# Altium schematic sheet AnalogValuePreparation.SchDoc
size A4; Address1: TH Nürnberg; Address2: Georg Simon Ohm; Address3: Kesslerplatz 10; Address4: 90489 Nürnberg; SheetNumber: 7; SheetTotal: 8
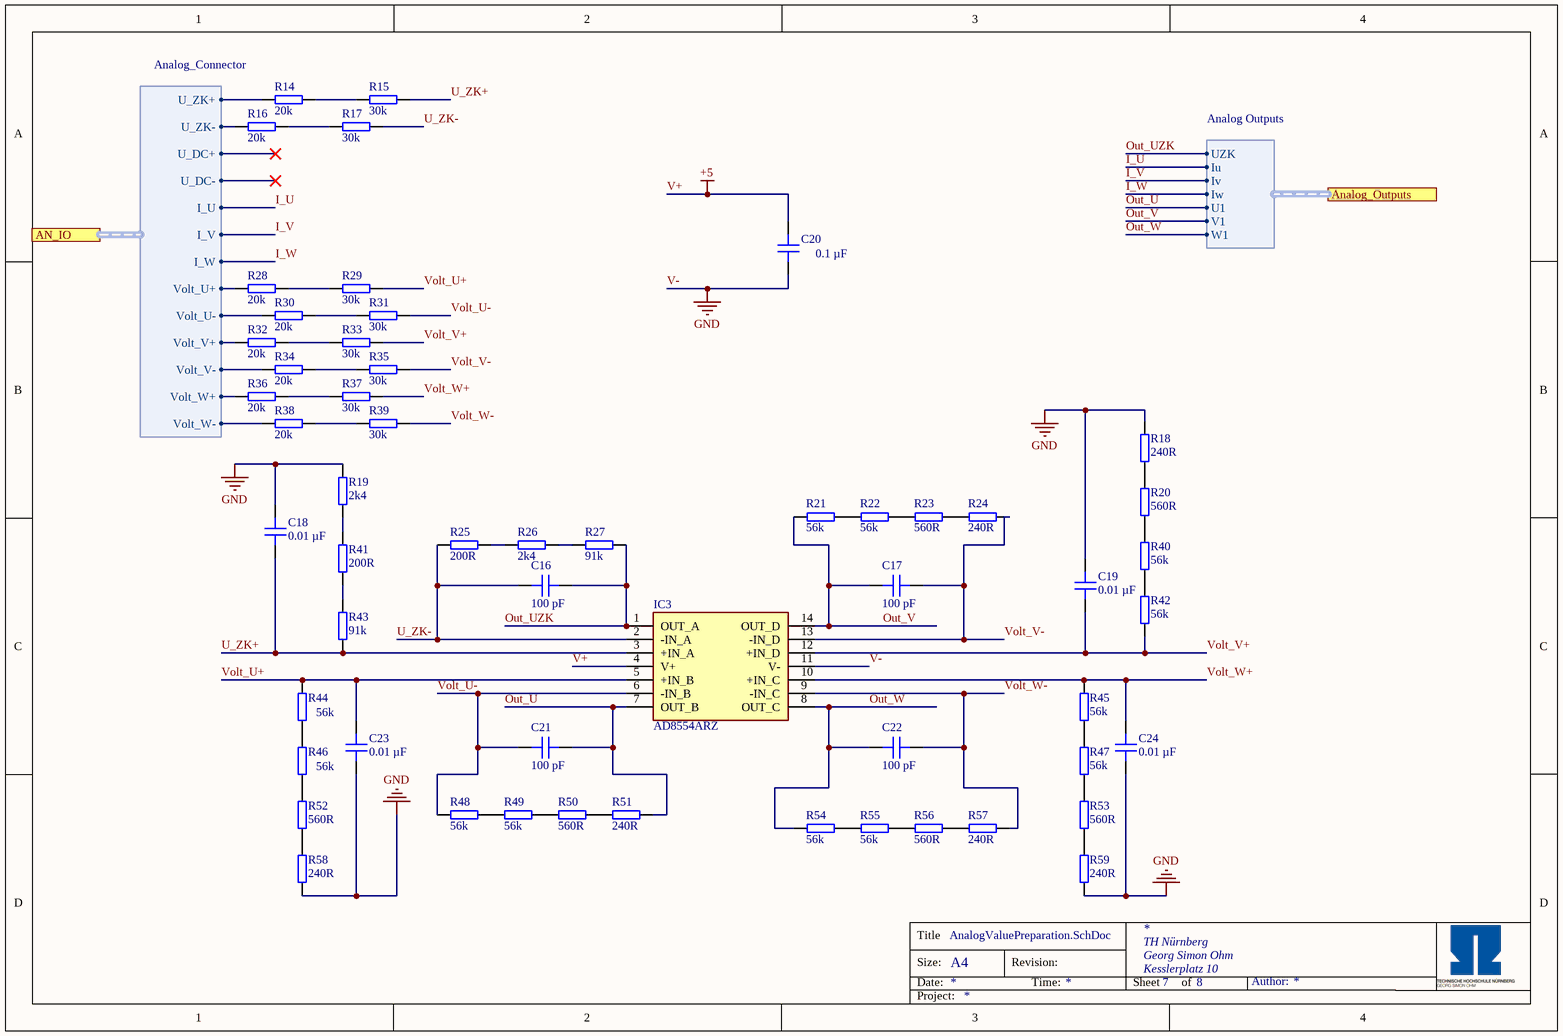
[diagram p0: AnalogValuePreparation.SchDoc]

## Parts
C16  100 pF  [C_0603]
C17  100 pF  [C_0603]
C18  0.01 µF  [C_0603]
C19  0.01 µF  [C_0603]
C20  0.1 µF  [C_0603]
C21  100 pF  [C_0603]
C22  100 pF  [C_0603]
C23  0.01 µF  [C_0603]
C24  0.01 µF  [C_0603]
IC3  AD8554ARZ  [SOIC127P600X175-14N]
R14  20k  [RES 0603_1608]
R15  30k  [RES 0603_1608]
R16  20k  [RES 0603_1608]
R17  30k  [RES 0603_1608]
R18  240R  [RES 0603_1608]
R19  2k4  [RES 0603_1608]
R20  560R  [RES 0603_1608]
R21  56k  [RES 0603_1608]
R22  56k  [RES 0603_1608]
R23  560R  [RES 0603_1608]
R24  240R  [RES 0603_1608]
R25  200R  [RES 0603_1608]
R26  2k4  [RES 0603_1608]
R27  91k  [RES 0603_1608]
R28  20k  [RES 0603_1608]
R29  30k  [RES 0603_1608]
R30  20k  [RES 0603_1608]
R31  30k  [RES 0603_1608]
R32  20k  [RES 0603_1608]
R33  30k  [RES 0603_1608]
R34  20k  [RES 0603_1608]
R35  30k  [RES 0603_1608]
R36  20k  [RES 0603_1608]
R37  30k  [RES 0603_1608]
R38  20k  [RES 0603_1608]
R39  30k  [RES 0603_1608]
R40  56k  [RES 0603_1608]
R41  200R  [RES 0603_1608]
R42  56k  [RES 0603_1608]
R43  91k  [RES 0603_1608]
R44  56k  [RES 0603_1608]
R45  56k  [RES 0603_1608]
R46  56k  [RES 0603_1608]
R47  56k  [RES 0603_1608]
R48  56k  [RES 0603_1608]
R49  56k  [RES 0603_1608]
R50  560R  [RES 0603_1608]
R51  240R  [RES 0603_1608]
R52  560R  [RES 0603_1608]
R53  560R  [RES 0603_1608]
R54  56k  [RES 0603_1608]
R55  56k  [RES 0603_1608]
R56  560R  [RES 0603_1608]
R57  240R  [RES 0603_1608]
R58  240R  [RES 0603_1608]
R59  240R  [RES 0603_1608]

## Ports
AN_IO (harness Analog_Connector), Analog_Outputs (harness Analog Outputs)

## Harnesses
Analog_Connector: U_ZK+, U_ZK-, U_DC+, U_DC-, I_V, I_U, I_W, Volt_U+, Volt_U-, Volt_V-, Volt_V+, Volt_W+, Volt_W-
Analog Outputs: UZK, Iu, Iw, Iv, U1, W1, V1

## Nets
V+: C20.2 IC3.4(V+)  [also labelled +5]
V-: C18.2 C19.2 C20.1 C23.2 C24.2 IC3.11(V-) R18.2 R19.2 R58.2 R59.2  [also labelled GND]
I_U: port AN_IO.I_U, port Analog_Outputs.Iu
I_V: port AN_IO.I_V, port Analog_Outputs.Iv
I_W: port AN_IO.I_W, port Analog_Outputs.Iw
Out_U: C21.1 IC3.7(OUT_B) R51.2 ; port Analog_Outputs.U1
Out_UZK: C16.2 IC3.1(OUT_A) R27.2 ; port Analog_Outputs.UZK
Out_V: C17.1 IC3.14(OUT_D) R21.1 ; port Analog_Outputs.V1
Out_W: C22.2 IC3.8(OUT_C) R54.1 ; port Analog_Outputs.W1
U_ZK+: C18.1 IC3.3(+IN_A) R15.2 R43.1
U_ZK-: C16.1 IC3.2(-IN_A) R17.2 R25.1
Volt_U+: C23.1 IC3.5(+IN_B) R29.2 R44.1
Volt_U-: C21.2 IC3.6(-IN_B) R31.2 R48.1
Volt_V+: C19.1 IC3.12(+IN_D) R33.2 R42.1
Volt_V-: C17.2 IC3.13(-IN_D) R24.2 R35.2
Volt_W+: C24.1 IC3.10(+IN_C) R37.2 R45.1
Volt_W-: C22.1 IC3.9(-IN_C) R39.2 R57.2
NetR14_1: R14.1 ; port AN_IO.U_ZK+
NetR14_2: R14.2 R15.1
NetR16_1: R16.1 ; port AN_IO.U_ZK-
NetR16_2: R16.2 R17.1
NetR18_1: R18.1 R20.2
NetR19_1: R19.1 R41.2
NetR20_1: R20.1 R40.2
NetR21_2: R21.2 R22.1
NetR22_2: R22.2 R23.1
NetR23_2: R23.2 R24.1
NetR25_2: R25.2 R26.1
NetR26_2: R26.2 R27.1
NetR28_1: R28.1 ; port AN_IO.Volt_U+
NetR28_2: R28.2 R29.1
NetR30_1: R30.1 ; port AN_IO.Volt_U-
NetR30_2: R30.2 R31.1
NetR32_1: R32.1 ; port AN_IO.Volt_V+
NetR32_2: R32.2 R33.1
NetR34_1: R34.1 ; port AN_IO.Volt_V-
NetR34_2: R34.2 R35.1
NetR36_1: R36.1 ; port AN_IO.Volt_W+
NetR36_2: R36.2 R37.1
NetR38_1: R38.1 ; port AN_IO.Volt_W-
NetR38_2: R38.2 R39.1
NetR40_1: R40.1 R42.2
NetR41_1: R41.1 R43.2
NetR44_2: R44.2 R46.1
NetR45_2: R45.2 R47.1
NetR46_2: R46.2 R52.1
NetR47_2: R47.2 R53.1
NetR48_2: R48.2 R49.1
NetR49_2: R49.2 R50.1
NetR50_2: R50.2 R51.1
NetR52_2: R52.2 R58.1
NetR53_2: R53.2 R59.1
NetR54_2: R54.2 R55.1
NetR55_2: R55.2 R56.1
NetR56_2: R56.2 R57.1

## Notes on the sheet
- Title
- Size:
- Date:
- A4
- Revision:
- Time:
- Sheet
- of
- Author:
- Project:

## Library data of the parts
C16 C17 C21 C22 = 885012006057: Capacitor 0603, 50 VDC, 100 pF, C0G; Manufacturer: Wuerth Elektronik; Tolerance: 5 %; Voltage Rating: 50 VDC; Created from: MGremer; Manufacturer Part Number: 885012006057; PartID: 44; Created On: 20.12.2020 13:54:13; ComponentLink1Description: Datasheet; ComponentLink1URL: https://www.mouser.de/datasheet/2/445/885012006057-1727261.pdf; Component Type: Capacitor 0603; Device Package: 0603; Last Updated: 20.12.2020 16:24:16; Mounting Type: SMD; Operating Temperature: -55 - 125°C; Series: WCAP-CSGP; Supplier 1: Mouser; Supplier Part Number 1: 710-885012006057; Type: Capacitor; Value: 100 pF; Live Cycle Status: 1; Stock number: not stored
C18 C19 C23 C24 = GCJ188R71H103KA01D: Capacitor 0603, 50 VDC, 0.01 µF, X7R; Manufacturer: muRata; Tolerance: 10 %; Voltage Rating: 50 VDC; Created from: MGremer; Manufacturer Part Number: GCJ188R71H103KA01D; PartID: 1; Created On: 20.12.2020 13:54:13; ComponentLink1Description: Datasheet; ComponentLink1URL: https://www.mouser.de/datasheet/2/281/c03e-516224.pdf; Component Type: Capacitor 0603; Device Package: 0603; Last Updated: 20.12.2020 16:24:16; Mounting Type: SMD; Operating Temperature: -55 - 125°C; Series: GCJ; Supplier 1: Mouser; Supplier Part Number 1: 81-GCJ188R71H103KA1D; Type: Capacitor; Value: 0.01 µF; Live Cycle Status: 1; Stock number: Labor SMD Container
C20 = C0603X104K5RAC7411: Capacitor 0603, 50 VDC, 0.1 µF, X7R; Manufacturer: KEMET; Tolerance: 10 %; Voltage Rating: 50 VDC; Created from: MGremer; Manufacturer Part Number: C0603X104K5RAC7411; PartID: 3; Created On: 20.12.2020 13:54:13; ComponentLink1Description: Datasheet; ComponentLink1URL: https://www.mouser.de/datasheet/2/212/1/KEM_C1013_X7R_FT_CAP_SMD-1103280.pdf; Component Type: Capacitor 0603; Device Package: 0603; Last Updated: 04.03.2021 09:24:28; Mounting Type: SMD; Operating Temperature: -55 - 125°C; Series: SMD Comm X7R Flex; Supplier 1: Mouser; Supplier Part Number 1: 80-C0603X104K5R7411; Supplier 2: LCSC; Supplier Part Number 2: C14663; Type: Capacitor; Value: 0.1 µF; Live Cycle Status: 1; LCSC Part Number: C14663; Stock number: Labor SMD Container
IC3 = AD8554ARZ: Differential Amplifier, 3V 1.5MHz, 145dB; Manufacturer: Analog Devices; Channels: 4; Value: Rail-to-Rail; Created from: TWilfling; Manufacturer Part Number: AD8554ARZ; PartID: 5; Created On: 07.05.2021 08:10:59; ComponentLink1Description: Datasheet; ComponentLink1URL: https://docs.rs-online.com/3587/0900766b814b3148.pdf; ComponentLink2Description: [NULL]; ComponentLink2URL: [NULL]; Component Type: Differential Amplifier; Device Package: SOIC-14; Last Updated: 07.05.2021 08:11:15; Mounting Type: SMD; Operating Temperature: -40 - 125°C; Supplier 1: RS; Supplier Part Number 1: 412-995; Type: Differential Amplifier; GBP: 1.5 MHz; CMRR: 145 dB; Live Cycle Status: 1; Stock number: not stored
R14 R16 R28 R30 R32 R34 R36 R38 = RK73B1JTTD203J: SMD resistor E24 series; Manufacturer: KOA Speer; Tolerance: 5%; Created from: MGremer; Manufacturer Part Number: RK73B1JTTD203J; PartID: 105; Created On: 14.12.2020 16:17:14; ComponentLink1Description: Datasheet; ComponentLink1URL: https://www.mouser.de/datasheet/2/219/RK73B-1825463.pdf; Component Type: SMD resistor; Device Package: 0603; Last Updated: 02.03.2021 14:07:32; Mounting Type: SMD; Supplier 1: Mouser; Supplier Part Number 1: 660-RK73B1JTTD203J; Type: Resistor; Value: 20k; Live Cycle Status: 1; Stock number: Labor SMD Container
R15 R17 R29 R31 R33 R35 R37 R39 = RK73B1JTTD303J: SMD resistor E24 series; Manufacturer: KOA Speer; Tolerance: 5%; Created from: MGremer; Manufacturer Part Number: RK73B1JTTD303J; PartID: 109; Created On: 14.12.2020 16:17:14; ComponentLink1Description: Datasheet; ComponentLink1URL: https://www.mouser.de/datasheet/2/219/RK73B-1825463.pdf; Component Type: SMD resistor; Device Package: 0603; Last Updated: 02.03.2021 14:07:32; Mounting Type: SMD; Supplier 1: Mouser; Supplier Part Number 1: 660-RK73B1JTTD303J; Type: Resistor; Value: 30k; Live Cycle Status: 1; Stock number: Labor SMD Container
R18 R24 R51 R57-R59 = RK73B1JTTDD241J: SMD resistor E24 series; Manufacturer: KOA Speer; Tolerance: 5%; Created from: MGremer; Manufacturer Part Number: RK73B1JTTDD241J; PartID: 59; Created On: 14.12.2020 16:17:14; ComponentLink1Description: Datasheet; ComponentLink1URL: https://www.mouser.de/datasheet/2/219/RK73B-1825463.pdf; Component Type: SMD resistor; Device Package: 0603; Last Updated: 02.03.2021 14:07:32; Mounting Type: SMD; Supplier 1: Mouser; Supplier Part Number 1: 660-RK73B1JTTDD241J; Type: Resistor; Value: 240R; Live Cycle Status: 1; Stock number: Labor SMD Container
R19 R26 = RK73B1JTTDD242J: SMD resistor E24 series; Manufacturer: KOA Speer; Tolerance: 5%; Created from: MGremer; Manufacturer Part Number: RK73B1JTTDD242J; PartID: 83; Created On: 14.12.2020 16:17:14; ComponentLink1Description: Datasheet; ComponentLink1URL: https://www.mouser.de/datasheet/2/219/RK73B-1825463.pdf; Component Type: SMD resistor; Device Package: 0603; Last Updated: 02.03.2021 14:07:32; Mounting Type: SMD; Supplier 1: Mouser; Supplier Part Number 1: 660-RK73B1JTTDD242J; Type: Resistor; Value: 2k4; Live Cycle Status: 1; Stock number: Labor SMD Container
R20 R23 R50 R52 R53 R56 = RK73B1JTTD561J: SMD resistor E24 series; Manufacturer: KOA Speer; Tolerance: 5%; Created from: MGremer; Manufacturer Part Number: RK73B1JTTD561J; PartID: 68; Created On: 14.12.2020 16:17:14; ComponentLink1Description: Datasheet; ComponentLink1URL: https://www.mouser.de/datasheet/2/219/RK73B-1825463.pdf; Component Type: SMD resistor; Device Package: 0603; Last Updated: 02.03.2021 14:07:32; Mounting Type: SMD; Supplier 1: Mouser; Supplier Part Number 1: 660-RK73B1JTTD561J; Type: Resistor; Value: 560R; Live Cycle Status: 1; Stock number: Labor SMD Container
R21 R22 R40 R42 R44-R49 R54 R55 = RK73B1JTTDD563J: SMD resistor E24 series; Manufacturer: KOA Speer; Tolerance: 5%; Created from: MGremer; Manufacturer Part Number: RK73B1JTTDD563J; PartID: 116; Created On: 14.12.2020 16:17:14; ComponentLink1Description: Datasheet; ComponentLink1URL: https://www.mouser.de/datasheet/2/219/RK73B-1825463.pdf; Component Type: SMD resistor; Device Package: 0603; Last Updated: 02.03.2021 14:07:32; Mounting Type: SMD; Supplier 1: Mouser; Supplier Part Number 1: 660-RK73B1JTTDD563J; Type: Resistor; Value: 56k; Live Cycle Status: 1; Stock number: Labor SMD Container
R25 R41 = RK73B1JTTD201J: SMD resistor E24 series; Manufacturer: KOA Speer; Tolerance: 5%; Created from: MGremer; Manufacturer Part Number: RK73B1JTTD201J; PartID: 57; Created On: 14.12.2020 16:17:14; ComponentLink1Description: Datasheet; ComponentLink1URL: https://www.mouser.de/datasheet/2/219/RK73B-1825463.pdf; Component Type: SMD resistor; Device Package: 0603; Last Updated: 02.03.2021 14:07:32; Mounting Type: SMD; Supplier 1: Mouser; Supplier Part Number 1: 660-RK73B1JTTD201J; Type: Resistor; Value: 200R; Live Cycle Status: 1; Stock number: Labor SMD Container
R27 R43 = RK73B1JTTDD913J: SMD resistor E24 series; Manufacturer: KOA Speer; Tolerance: 5%; Created from: MGremer; Manufacturer Part Number: RK73B1JTTDD913J; PartID: 121; Created On: 14.12.2020 16:17:14; ComponentLink1Description: Datasheet; ComponentLink1URL: https://www.mouser.de/datasheet/2/219/RK73B-1825463.pdf; Component Type: SMD resistor; Device Package: 0603; Last Updated: 02.03.2021 14:07:32; Mounting Type: SMD; Supplier 1: Mouser; Supplier Part Number 1: 660-RK73B1JTTDD913J; Type: Resistor; Value: 91k; Live Cycle Status: 1; Stock number: Labor SMD Container